# Altium schematic sheet wenya_sheet.SchDoc
size A4
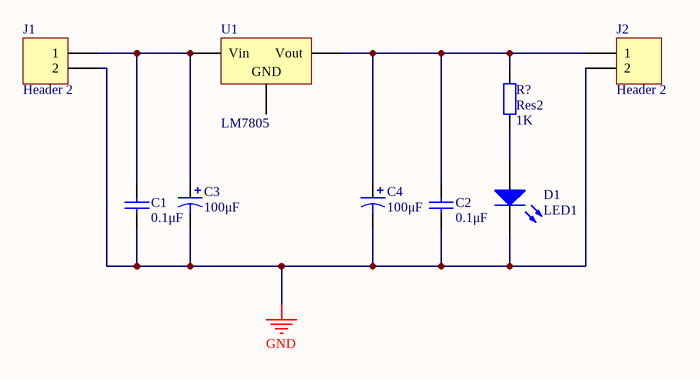
[diagram p0: wenya_sheet.SchDoc]

## Parts
C1  value 0.1μF  [RAD-0.3]  (hidden comment: Cap)
C2  value 0.1μF  [RAD-0.3]  (hidden comment: Cap)
C3  value 100μF  [RB7.6-15]  (hidden comment: Cap Pol1)
C4  value 100μF  [RB7.6-15]  (hidden comment: Cap Pol1)
D1  LED1  [LED-1]
J1  Header 2  [HDR1X2]
J2  Header 2  [HDR1X2]
R?  Res2  value 1K  [AXIAL-0.4]
U1  LM7805  [TO254P1510-3_4L]

## Nets
GND: C1.1 C2.1 C3.2 C4.2 D1.2(K) J1.2 J2.2
NetC1_2: C1.2 C3.1 J1.1 U1.1(Vin)
NetC2_2: C2.2 C4.1 J2.1 R?.2 U1.3(Vout)
NetD1_1: D1.1(A) R?.1

Not connected (* = marked no-connect by the designer): U1 2(GND)

## Library data of the parts
C1 C2 = Cap: Capacitor; Published: 8-Jun-2000; LatestRevisionDate: 17-Jul-2002; LatestRevisionNote: Re-released for DXP Platform.; PackageReference: RAD-0.3; Publisher: Altium Limited
C3 C4 = Cap Pol1: Polarized Capacitor (Radial); Published: 8-Jun-2000; LatestRevisionDate: 17-Jul-2002; LatestRevisionNote: Re-released for DXP Platform.; PackageReference: RB7.6-15; Publisher: Altium Limited
D1 = LED1: Typical RED GaAs LED; Published: 8-Jun-2000; LatestRevisionDate: 08-Jul-2005; LatestRevisionNote: Mech Layer 1 removed.; PackageReference: LED-1; Publisher: Altium Limited
J1 J2 = Header 2: Header, 2-Pin; LatestRevisionDate: 17-Jul-2002; LatestRevisionNote: Re-released for DXP Platform.; Publisher: Altium Limited
R? = Res2: Resistor; Published: 8-Jun-2000; LatestRevisionDate: 17-Jul-2002; LatestRevisionNote: Re-released for DXP Platform.; PackageReference: AXIAL-0.4; Publisher: Altium Limited
U1 = Volt Reg: Voltage Regulator; Published: 24-Mar-1999; LatestRevisionDate: 29-May-2009; LatestRevisionNote: IPC-7351 Footprint Added.; PackageReference: D2PAK; Publisher: Altium Limited; PackageDescription: 3-Pin Transistor Outline Package 2.54 mm Pitch, 15.1 mm Lead Span